# EAGLE design PCE - TG16 (EAGLE 9.6.2)
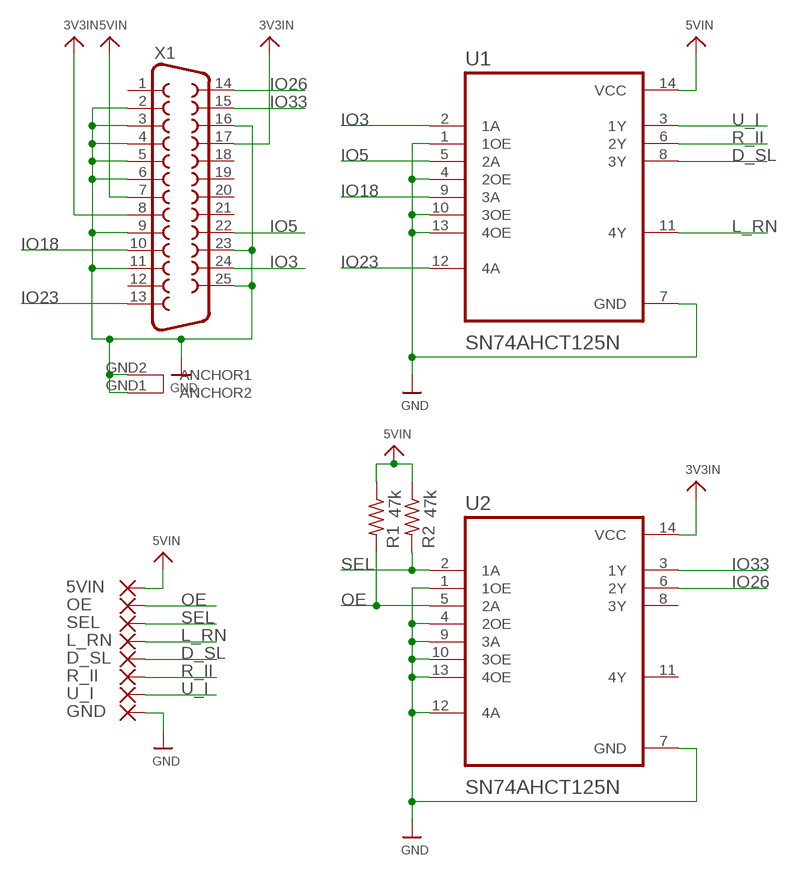
[diagram p0: schematic, sheet 1]

## Parts
5VIN  SMD5  [SMD2,54-5,08]
D_SL  SMD5  [SMD2,54-5,08]
GND  SMD5  [SMD2,54-5,08]
L_RN  SMD5  [SMD2,54-5,08]
OE  SMD5  [SMD2,54-5,08]
R1  47k  R-US_R1206  [R1206]
R2  47k  R-US_R1206  [R1206]
R_II  SMD5  [SMD2,54-5,08]
SEL  SMD5  [SMD2,54-5,08]
U1  SN74AHCT125N  [DIP794W45P254L1969H508Q14]
U2  SN74AHCT125N  [DIP794W45P254L1969H508Q14]
U_I  SMD5  [SMD2,54-5,08]
X1  DB25_FEMALEHP  [F25HP]

## Nets
3V3IN: U2.14(VCC) X1.8 X1.17
5VIN: 5VIN.1(P) R1.1 R2.1 U1.14(VCC) X1.7
D_SL: D_SL.1(P) U1.8(3Y)
GND: GND.1(P) U1.1(1OE) U1.4(2OE) U1.7(GND) U1.10(3OE) U1.13(4OE) U2.1(1OE) U2.4(2OE) U2.7(GND) U2.9(3A) U2.10(3OE) U2.12(4A) U2.13(4OE) X1.2 X1.3 X1.4 X1.5 X1.6 X1.9 X1.11 X1.16 X1.23 X1.25 X1.GND1(ANCHOR2) X1.GND2(ANCHOR1)
IO3: U1.2(1A) X1.24
IO5: U1.5(2A) X1.22
IO18: U1.9(3A) X1.10
IO23: U1.12(4A) X1.13
IO26: U2.6(2Y) X1.14
IO33: U2.3(1Y) X1.15
L_RN: L_RN.1(P) U1.11(4Y)
OE: OE.1(P) R1.2 U2.5(2A)
R_II: R_II.1(P) U1.6(2Y)
SEL: R2.2 SEL.1(P) U2.2(1A)
U_I: U1.3(1Y) U_I.1(P)
Unconnected: U2.8(3Y) U2.11(4Y) X1.1 X1.12 X1.18 X1.19 X1.20 X1.21

## Library data of the parts
5VIN D_SL GND L_RN OE R_II SEL U_I = wirepad:SMD5: SMD PAD
R1 R2 = adafruit:R-US_: RESISTOR, American symbol
U1 U2 = SN74AHCT125N:SN74AHCT125N: None Check prices <https://pricing.snapeda.com/parts/SN74AHCT125N/Texas%20Instruments/view-part?ref=eda>; AVAILABILITY: In Stock; DESCRIPTION: Quadruple Bus Buffer Gates With 3-State Outputs 14-PDIP -40 to 125; MF: Texas Instruments; MP: SN74AHCT125N; PACKAGE: PDIP-14 Texas Instruments; PRICE: None; PURCHASE-URL: https://pricing.snapeda.com/search/part/SN74AHCT125N/?ref=eda
X1 = SparkFun-Retired:DB25_FEMALE: 25 Pin male connector. PCB edge mount for regular PCB thicknesses. This connector will connect directly to the back of a PC parallel port or through a normal DB25 extension cable (M/F). SKU: PRT-08287

## Board
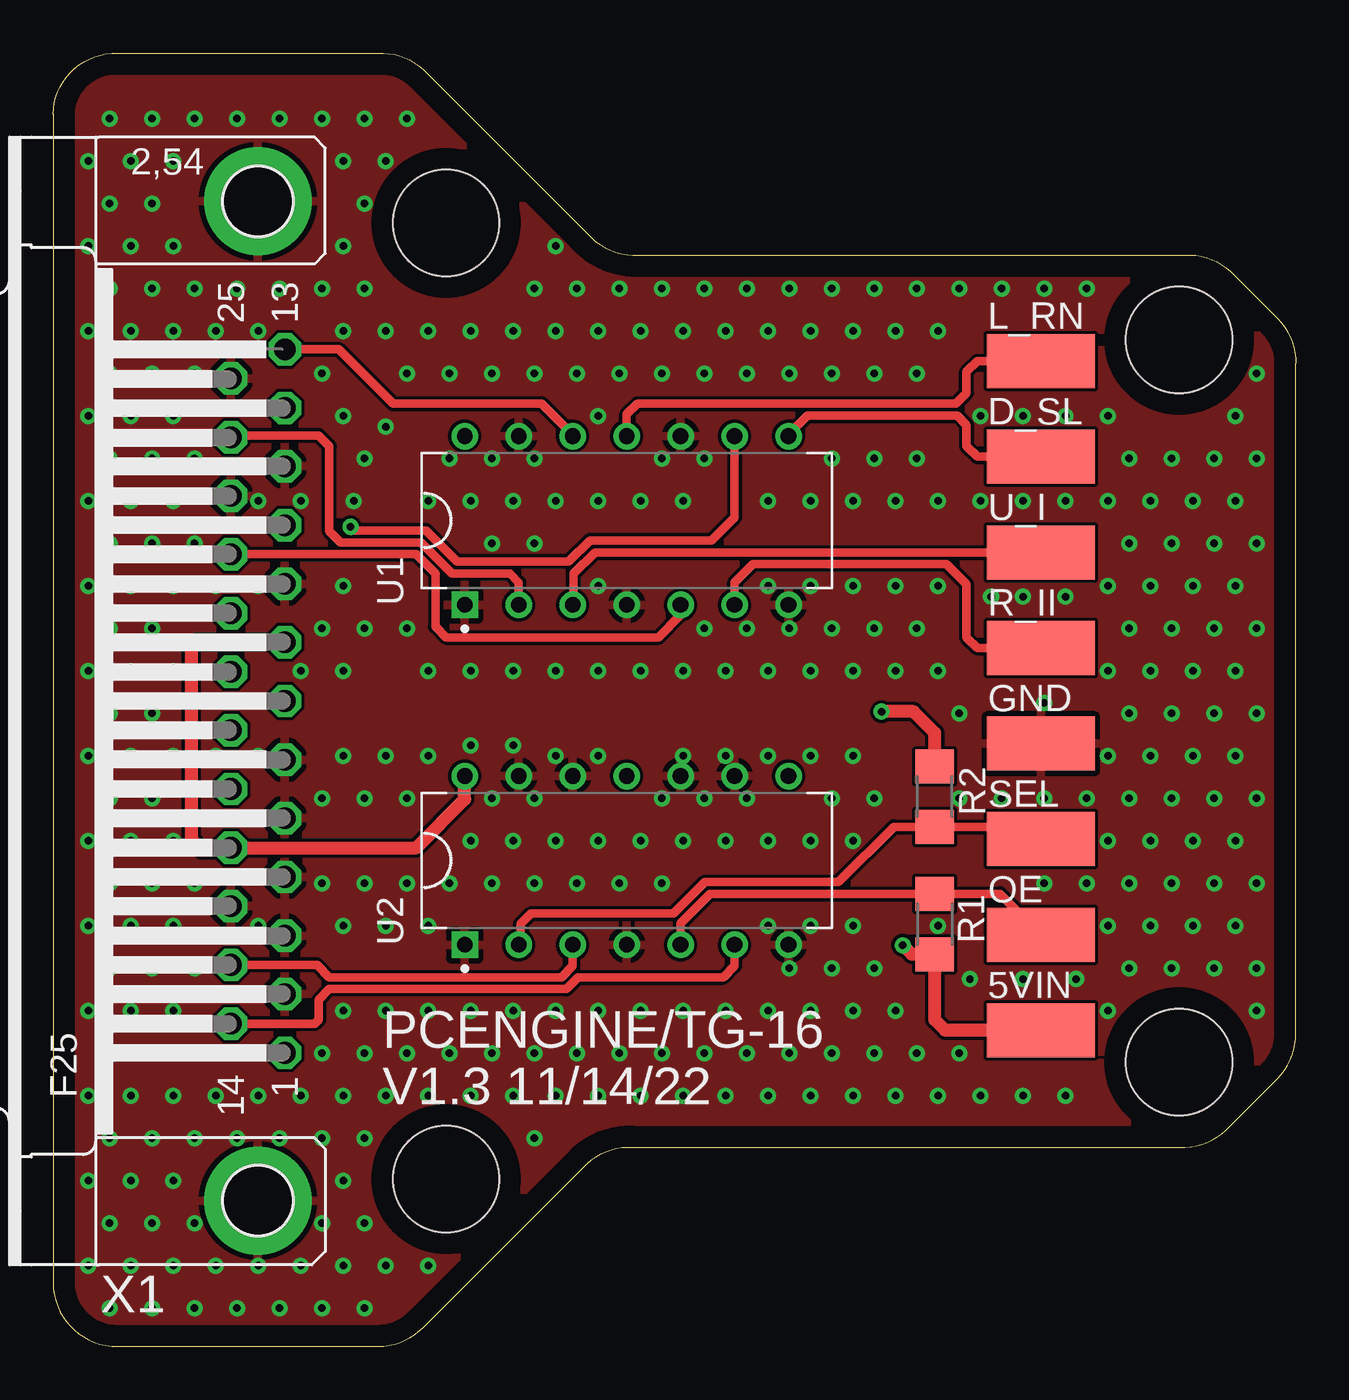
[diagram p1: board, top side]
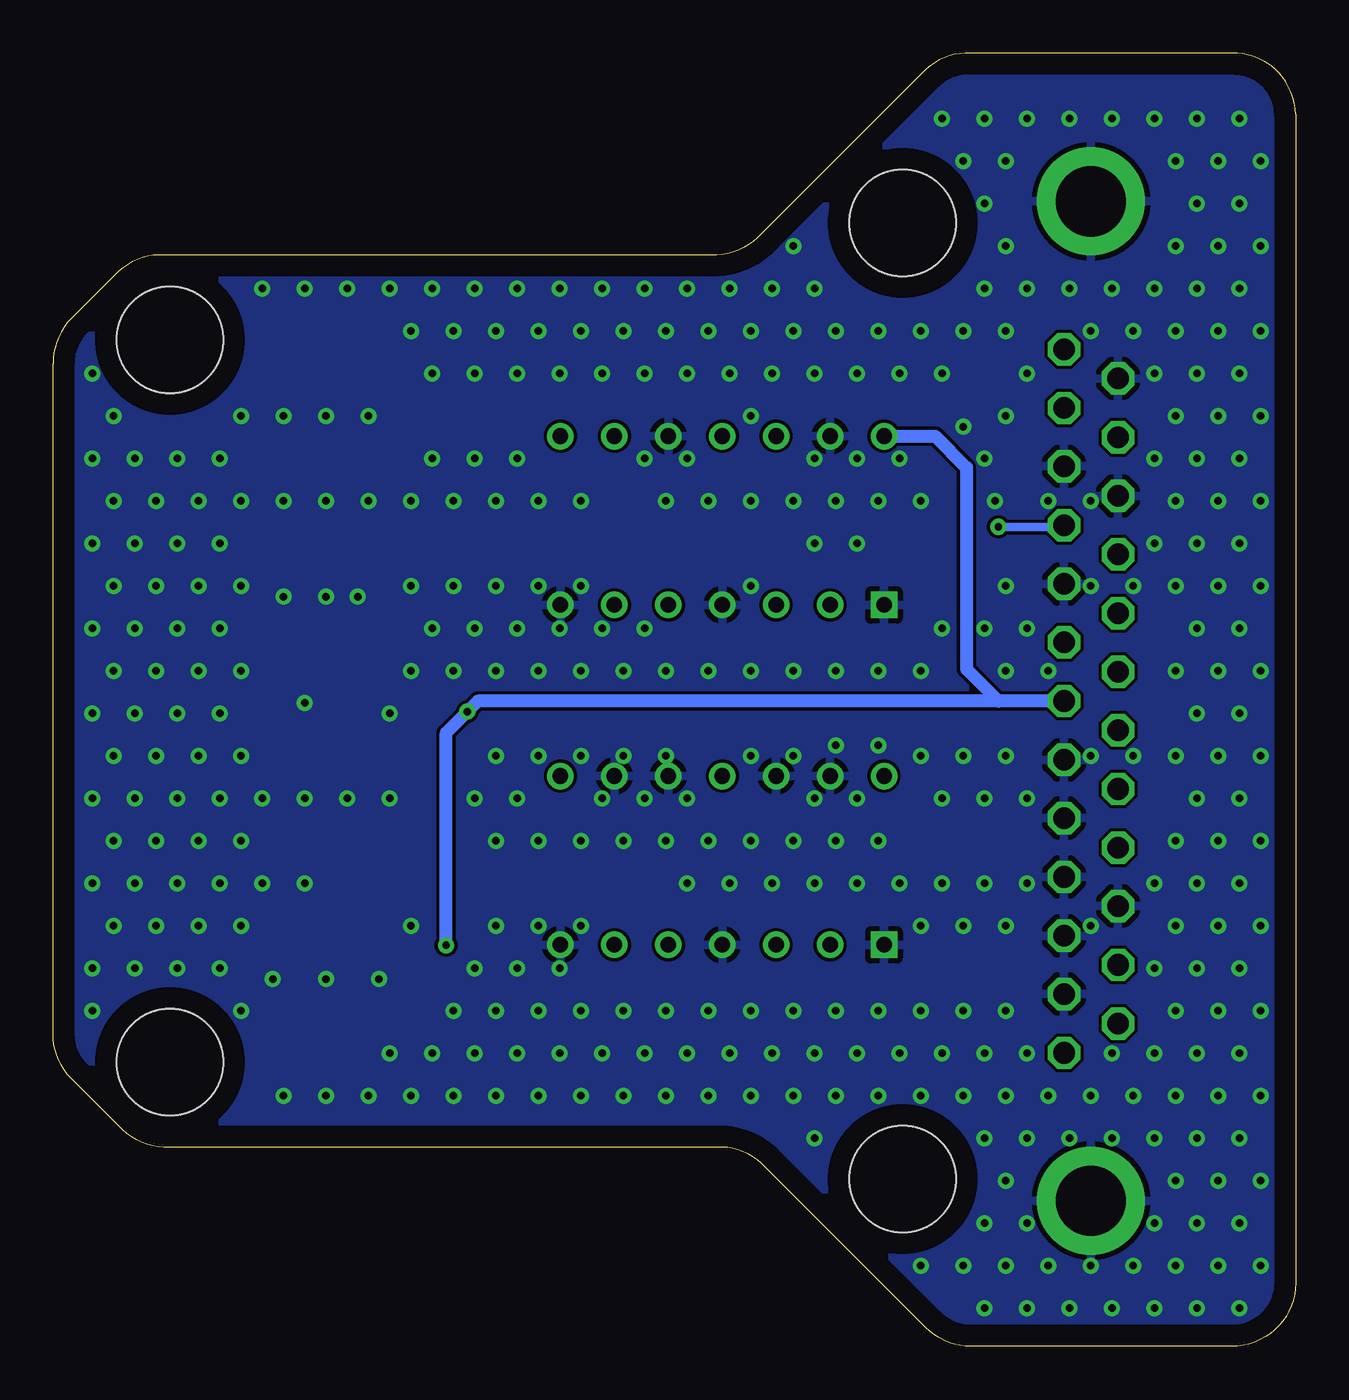
[diagram p2: board, bottom side, seen from below]

Size 58.5 x 60.88 mm. Coordinates in mm from the lower left corner, seen from the top.
Outline: 0,58 0,3 arc90 3.03,0 15.29,0 arc45 17.41,0.88 25.15,8.62 arc-45 27.27,9.38 53.29,9.38 arc45 55.41,10.38 57.65,12.62 arc45 58.5,14.74 58.5,46.26 arc45 57.65,48.38 55.41,50.62 arc45 53.29,51.38 27.27,51.38 arc-45 25.15,52.38 17.41,60.12 arc45 15.29,60.88 3.03,60.88 arc90 0,58
Copper layers (1*16): Top 0.035mm / dielectric 1.5mm / Bottom 0.035mm
Design rules "default": minimum track width 6mil, minimum drill 0.35mm, track to track 6mil, track to pad 6mil, pad to pad 6mil, via to via 6mil, smd to smd 6mil, copper to edge 40mil, drill to drill 6mil, minimum pad ring 10mil, minimum via ring 8mil, stop-mask expansion 4mil, vias tented up to drill 0.5mm, thermal gap 10mil
Holes 5 mm at 53,13.38 53,47.38 18.5,52.88 18.5,7.88

### Footprints (pad centres in the part's own frame; a part is rotated, then mirrored left to right if it is on the bottom)
SMD2,54-5,08 = smd 2.54 x 5.08: 1 0,0
R1206 = smd 1.6 x 1.803: 1 -1.422,0; 2 1.422,0
DIP794W45P254L1969H508Q14 = drill 0.74 pad 1.14 square: 1 -3.97,7.62 | drill 0.74 pad 1.14: 2 -3.97,5.08; 3 -3.97,2.54; 4 -3.97,0; 5 -3.97,-2.54; 6 -3.97,-5.08; 7 -3.97,-7.62; 8 3.97,-7.62; 9 3.97,-5.08; 10 3.97,-2.54; 11 3.97,0; 12 3.97,2.54; 13 3.97,5.08; 14 3.97,7.62
F25HP = drill 1.016 octagon: 1 -16.561,-1.27; 2 -13.792,-1.27; 3 -11.049,-1.27; 4 -8.28,-1.27; 5 -5.512,-1.27; 6 -2.769,-1.27; 7 0,-1.27; 8 2.769,-1.27; 9 5.512,-1.27; 10 8.28,-1.27; 11 11.049,-1.27; 12 13.792,-1.27; 13 16.561,-1.27; 14 -15.189,1.27; 15 -12.421,1.27; 16 -9.652,1.27; 17 -6.909,1.27; 18 -4.14,1.27; 19 -1.372,1.27; 20 1.372,1.27; 21 4.14,1.27; 22 6.909,1.27; 23 9.652,1.27; 24 12.421,1.27; 25 15.189,1.27 | drill 3.302 pad 5.08: GND1 -23.52,0; GND2 23.52,0

### Placement (x,y rotation side)
5VIN  46.5,14.88 270 top
D_SL  46.5,41.88 270 top
GND  46.5,28.38 270 top
L_RN  46.5,46.38 270 top
OE  46.5,19.38 270 top
R1  41.5,19.88 90 top
R2  41.5,25.88 270 top
R_II  46.5,32.88 270 top
SEL  46.5,23.88 270 top
U1  27,38.88 90 top
U2  27,22.88 90 top
U_I  46.5,37.38 270 top
X1  9.64,30.38 90 top

### Tracks (layer width: path | path; a pad name or v marks a point on that pad's centre or on a via)
3V3IN
  Top 0.61: U2.14 19.38,25.76 17.09,23.47 X1.17 8.28,23.38 7,23.38 6.5,23.88 6.5,32.88 6.77,33.15 X1.8
5VIN  (via drill 0.35)
  Top 0.61: 5VIN.1 42,14.88 41.5,15.38 R1.1 40.42,18.46 v40,18.88 | R2.1 41.5,28.88 40.5,29.88 v39,29.88
  Bottom 0.61: v40,18.88 40,28.88 v39,29.88 38.5,30.38 14,30.38 | X1.7 14,30.38 | U1.14 16.97,42.85 15.5,41.38 15.5,31.88 14,30.38
D_SL
  Top 0.406: D_SL.1 43.5,41.88 43,42.38 43,43.38 42.56,43.82 35.5,43.82 34.62,42.94 U1.8
GND  (via drill 0.35)
  other vias: 2.66,1.8 1.66,3.8 2.66,5.8 1.66,7.8 2.66,9.8 1.66,11.8 2.66,13.8 1.66,15.8 2.66,17.8 1.66,19.8 2.66,21.8 1.66,23.8 2.66,25.8 1.66,27.8 2.66,29.8 1.66,31.8 2.66,33.8 1.66,35.8 2.66,37.8 1.66,39.8 2.66,41.8 1.66,43.8 2.66,45.8 1.66,47.8 2.66,49.8 1.66,51.8 2.66,53.8 1.66,55.8 2.66,57.8 4.66,1.8 3.66,3.8 4.66,5.8 3.66,7.8 4.66,9.8 3.66,11.8 4.66,13.8 3.66,15.8 4.66,17.8 3.66,19.8 4.66,21.8 3.66,23.8 4.66,25.8 3.66,27.8 4.66,29.8 3.66,31.8 4.66,33.8 3.66,35.8 4.66,37.8 3.66,39.8 4.66,41.8 3.66,43.8 4.66,45.8 3.66,47.8 4.66,49.8 3.66,51.8 4.66,53.8 3.66,55.8 4.66,57.8 6.66,1.8 5.66,3.8 6.66,5.8 5.66,7.8 6.66,9.8 5.66,11.8 6.66,13.8 5.66,15.8 6.66,17.8 5.66,19.8 6.66,21.8 5.66,23.8 5.66,27.8 5.66,31.8 5.66,35.8 6.66,37.8 5.66,39.8 6.66,41.8 5.66,43.8 6.66,45.8 5.66,47.8 6.66,49.8 5.66,51.8 5.66,55.8 6.66,57.8 8.66,1.8 7.66,3.8 8.66,9.8 7.66,11.8 8.66,13.8 7.66,27.8 7.66,35.8 7.66,47.8 8.66,49.8 8.66,57.8 10.66,1.8 9.66,3.8 10.66,9.8 9.66,11.8 9.66,19.8 9.66,27.8 9.66,35.8 9.66,39.8 9.66,47.8 10.66,49.8 10.66,57.8 12.66,1.8 11.66,3.8 12.66,5.8 12.66,9.8 11.66,11.8 12.66,13.8 12.66,21.8 12.66,25.8 11.66,31.8 12.66,33.8 11.66,39.8 12.66,45.8 12.66,49.8 12.66,57.8 14.66,1.8 13.66,3.8 14.66,5.8 13.66,7.8 14.66,9.8 13.66,11.8 14.66,13.8 13.66,15.8 13.66,19.8 14.66,21.8 14.66,25.8 13.66,27.8 13.66,31.8 14.66,33.8 13.66,35.8 14.16,39.8 14.66,41.8 13.66,43.8 13.66,47.8 14.66,49.8 13.66,51.8 14.66,53.8 13.66,55.8 14.66,57.8 15.66,3.8 15.66,11.8 16.66,13.8 15.66,15.8 15.66,19.8 16.66,21.8 16.66,25.8 15.66,27.8 16.66,33.8 15.66,43.3 16.66,45.8 15.66,47.8 15.66,55.8 16.66,57.8 17.66,3.8 17.66,11.8 18.66,13.8 17.66,15.8 17.66,19.8 18.66,21.8 17.66,27.8 17.66,31.8 17.66,39.8 18.66,41.8 18.66,45.8 17.66,47.8 19.66,11.8 20.66,13.8 19.66,15.8 20.66,21.8 19.66,23.8 20.66,25.8 19.66,28.3 19.66,31.8 20.66,37.8 19.66,39.8 20.66,41.8 20.66,45.8 19.66,47.8 22.66,9.8 21.66,11.8 22.66,13.8 21.66,15.8 22.66,21.8 21.66,23.8 22.66,25.8 21.66,28.3 21.66,31.8 22.66,37.8 21.66,39.8 22.66,41.8 22.66,45.8 21.66,47.8 22.66,49.8 23.66,11.8 24.66,13.8 23.66,15.8 24.66,21.8 23.66,23.8 23.66,27.8 23.66,31.8 23.66,39.8 24.66,45.8 23.66,47.8 24.66,49.8 23.66,51.8 25.66,11.8 26.66,13.8 25.66,15.8 26.66,21.8 25.66,23.8 25.66,27.8 25.66,31.8 25.66,35.8 25.66,39.8 25.66,43.8 26.66,45.8 25.66,47.8 26.66,49.8 27.66,11.8 28.66,13.8 27.66,15.8 28.66,21.8 27.66,23.8 28.66,25.8 27.66,31.8 27.66,39.8 28.66,41.8 28.66,45.8 27.66,47.8 28.66,49.8 29.66,11.8 30.66,13.8 29.66,15.8 29.66,23.8 30.66,25.8 29.66,27.8 29.66,31.8 30.66,33.8 29.66,39.8 30.66,41.8 30.66,45.8 29.66,47.8 30.66,49.8 31.66,11.8 32.66,13.8 31.66,15.8 31.66,23.8 32.66,25.8 31.66,27.8 31.66,31.8 32.66,33.8 32.66,45.8 31.66,47.8 32.66,49.8 33.66,11.8 34.66,13.8 33.66,15.8 34.66,17.8 33.66,19.8 33.66,23.8 33.66,27.8 33.66,31.8 34.66,33.8 33.66,35.8 33.66,39.8 34.66,45.8 33.66,47.8 34.66,49.8 35.66,11.8 36.66,13.8 35.66,15.8 36.66,17.8 35.66,19.8 35.66,23.8 36.66,25.8 35.66,27.8 35.66,31.8 36.66,33.8 35.66,35.8 35.66,39.8 36.66,41.8 36.66,45.8 35.66,47.8 36.66,49.8 37.66,11.8 38.66,13.8 37.66,15.8 38.66,17.8 37.66,19.8 37.66,23.8 38.66,25.8 37.66,27.8 37.66,31.8 38.66,33.8 37.66,35.8 37.66,39.8 38.66,41.8 38.66,45.8 37.66,47.8 38.66,49.8 39.66,11.8 40.66,13.8 39.66,15.8 48.16,17.3 39.66,31.8 40.66,33.8 39.66,35.8 39.66,39.8 40.66,41.8 40.66,45.8 39.66,47.8 40.66,49.8 41.66,11.8 42.66,13.8 43.16,17.3 41.66,19.8 42.66,25.8 42.66,29.8 41.66,31.8 41.66,35.8 41.66,39.8 41.66,47.8 42.66,49.8 43.66,11.8 45.66,17.3 44.66,25.8 44.16,35.3 43.66,39.8 43.66,43.8 44.66,49.8 45.66,11.8 46.66,21.8 46.66,25.8 46.66,30.3 45.66,35.3 45.66,39.8 45.66,43.8 46.66,49.8 47.66,11.8 48.66,21.8 48.66,25.8 47.66,35.3 47.66,39.8 47.66,43.8 48.66,49.8 49.66,15.8 50.66,17.8 49.66,19.8 50.66,21.8 49.66,23.8 50.66,25.8 49.66,27.8 50.66,29.8 49.66,31.8 50.66,33.8 49.66,35.8 50.66,37.8 49.66,39.8 50.66,41.8 49.66,43.8 52.66,17.8 51.66,19.8 52.66,21.8 51.66,23.8 52.66,25.8 51.66,27.8 52.66,29.8 51.66,31.8 52.66,33.8 51.66,35.8 52.66,37.8 51.66,39.8 52.66,41.8 54.66,17.8 53.66,19.8 54.66,21.8 53.66,23.8 54.66,25.8 53.66,27.8 54.66,29.8 53.66,31.8 54.66,33.8 53.66,35.8 54.66,37.8 53.66,39.8 54.66,41.8 56.66,15.8 56.66,17.8 55.66,19.8 56.66,21.8 55.66,23.8 56.66,25.8 55.66,27.8 56.66,29.8 55.66,31.8 56.66,33.8 55.66,35.8 56.66,37.8 55.66,39.8 56.66,41.8 55.66,43.8 56.66,45.8
  pour Bottom: 0.03,0 0.03,61 28.53,61 28.53,51.5 59.03,51.5 59.03,9.5 28.03,9.5 28.03,0
  pour Top: 0.03,0 0.03,61 28.53,61 28.53,51.5 59.03,51.5 59.03,9.5 28.03,9.5 28.03,0
IO3
  Top 0.406: U1.2 21.92,35.96 21.5,36.38 18.79,36.38 17.32,37.85 13.53,37.85 13,38.38 13,42.38 12.5,42.88 8.45,42.88 X1.24
IO5
  Top 0.406: X1.22 17.09,37.29 18,36.38 18,33.88 18.5,33.38 28.5,33.38 29.54,34.42 U1.5
IO18  (via drill 0.35)
  Top 0.406: U1.9 32.08,39.02 31,37.94 25.27,37.94 24.27,36.94 19.02,36.94 17.55,38.41 14.18,38.41 v14,38.58
  Bottom 0.406: v14,38.58 10.99,38.58 X1.10
IO23
  Top 0.406: X1.13 13.44,46.94 16,44.38 23,44.38 24.46,42.92 U1.12
IO26
  Top 0.406: X1.14 12.31,15.19 12.5,15.38 12.5,16.32 13,16.82 24.16,16.82 24.72,17.38 31.55,17.38 32.08,17.91 U2.6
IO33
  Top 0.406: X1.15 12.42,17.96 13,17.38 23.93,17.38 24.46,17.91 U2.3
L_RN
  Top 0.406: L_RN.1 43.5,46.38 43,45.88 43,44.88 42.5,44.38 27.5,44.38 27,43.88 U1.11
OE
  Top 0.406: OE.1 44.58,21.3 R1.2 30.92,21.3 29.54,19.92 U2.5
R_II
  Top 0.406: R_II.1 43.5,32.88 43,33.38 43,35.88 42.06,36.82 32.94,36.82 32.08,35.96 U1.6
SEL
  Top 0.406: SEL.1 45.92,24.46 R2.2 39.58,24.46 36.98,21.86 30.69,21.86 29.21,20.38 22.5,20.38 22,19.88 22,18.99 U2.2
U_I
  Top 0.406: U1.3 24.5,34.95 24.5,36.38 25.5,37.38 U_I.1

### Text on the board
tPlace: PCENGINE/TG-16 / V1.3 11/14/22
tValues: CONNECT CABLE / SHIELD TO GND